# EAGLE design PixiFlood (EAGLE 9.4.2)
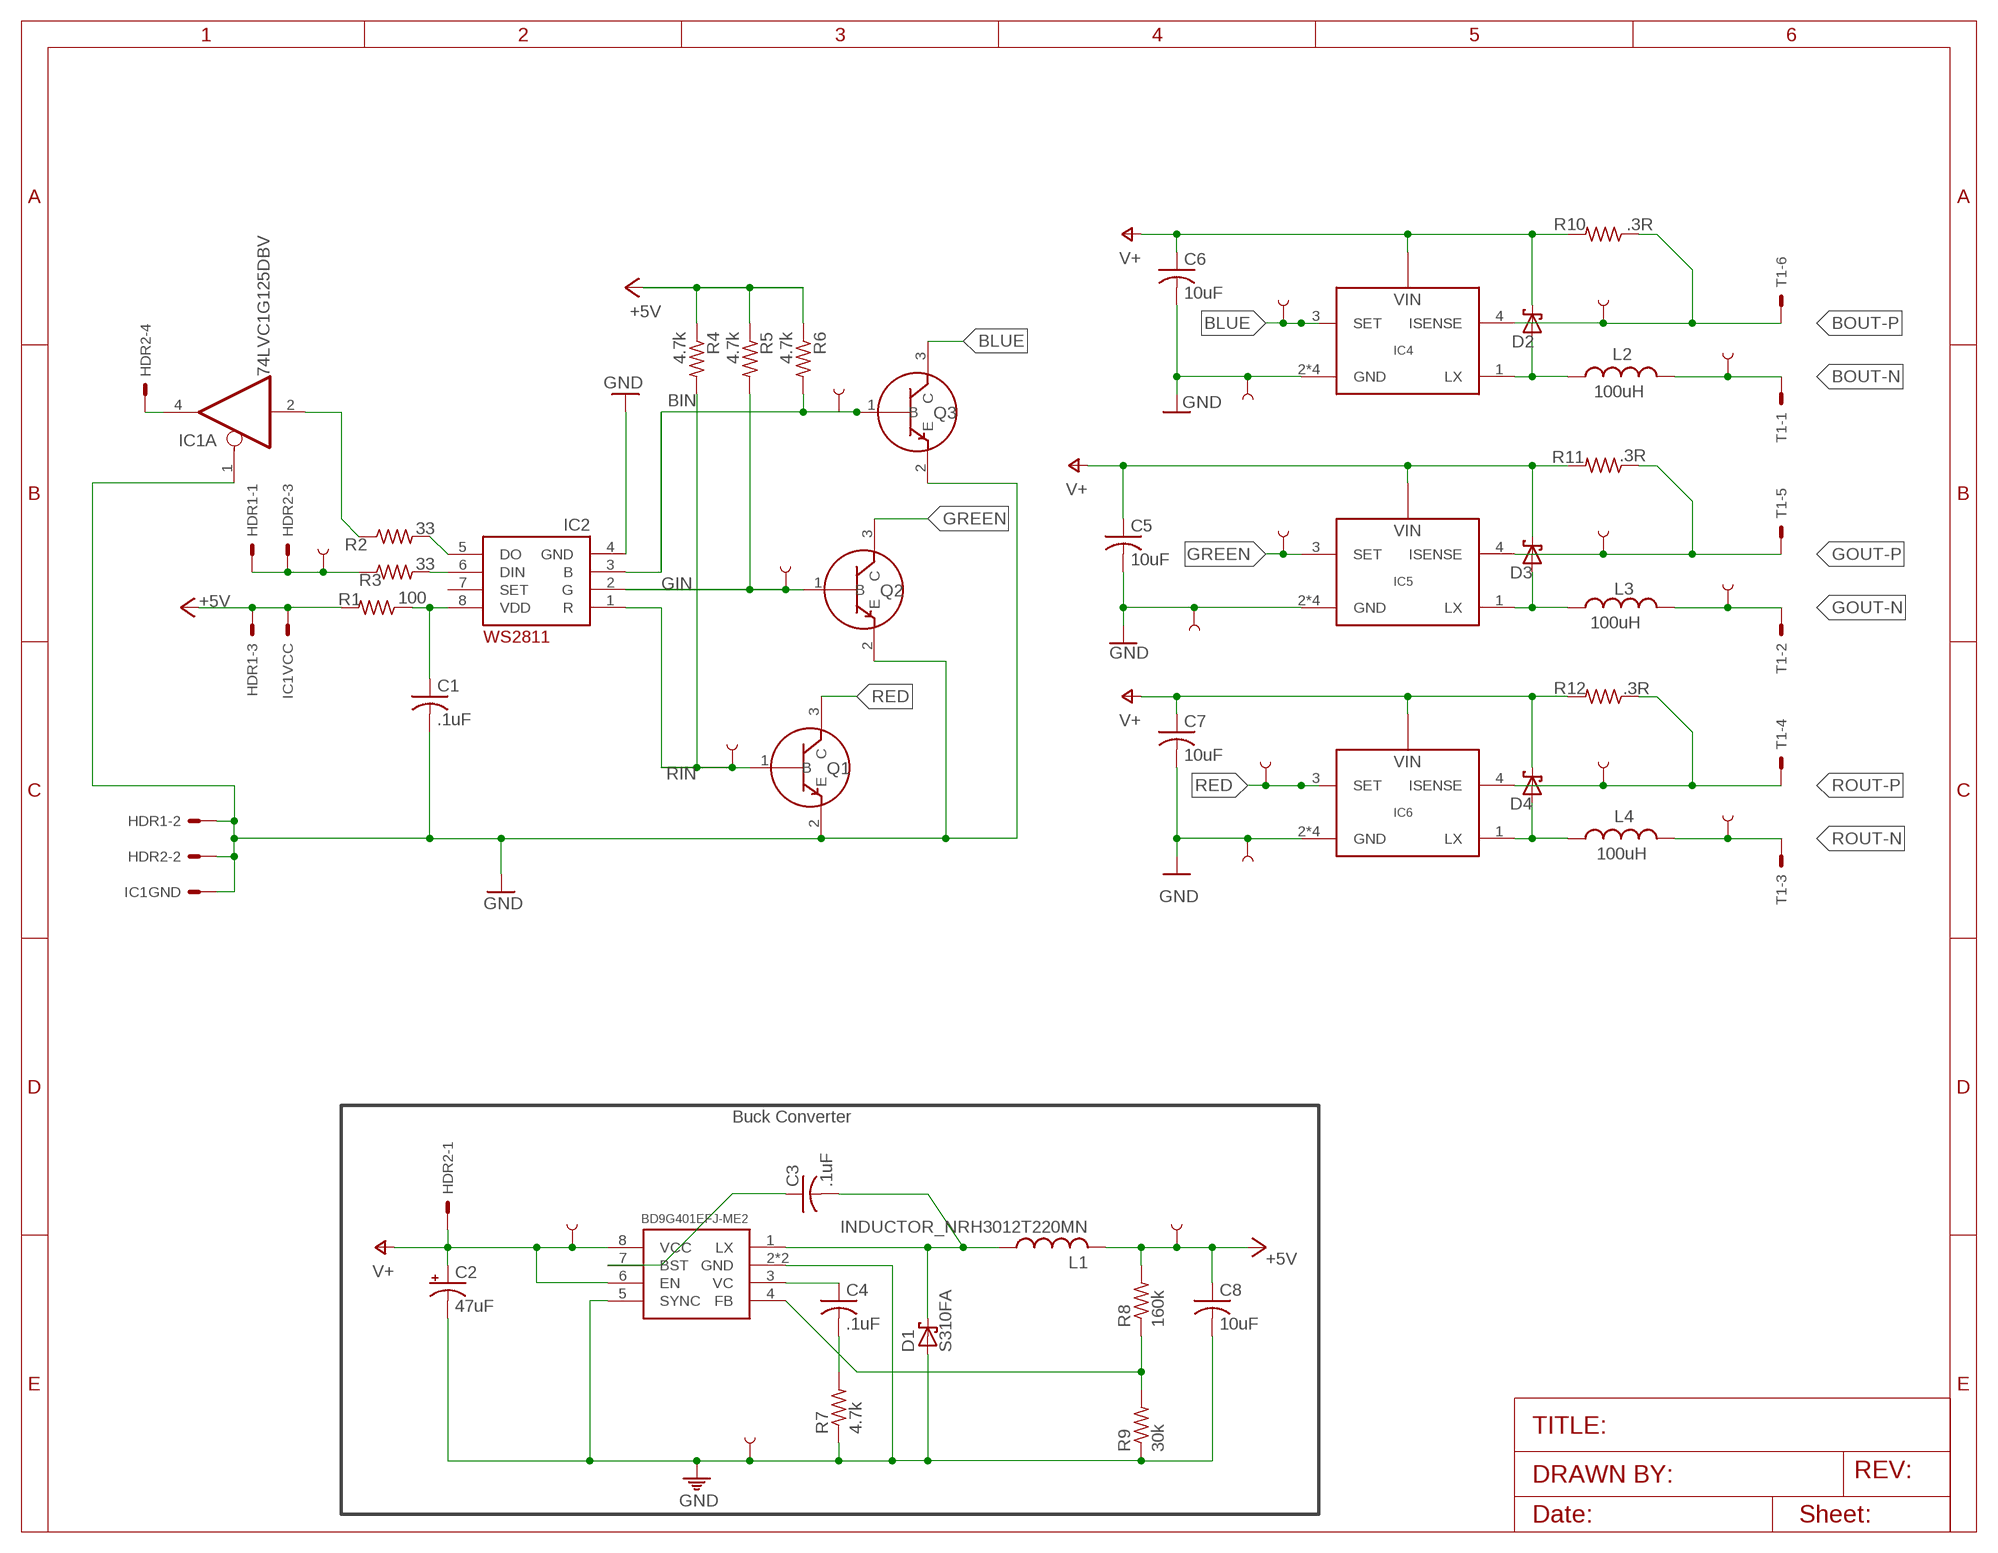
[diagram p0: schematic, sheet 1]

## Parts
C1  .1uF  C-USC0805  [C0805]
C2  47uF  CPOL-USUD-6,3X7,7  [UD-6,3X7,7_NICHICON]
C3  .1uF  C-USC0805  [C0805]
C4  .1uF  C-USC0805  [C0805]
C5  10uF  C-USC1206  [C1206]
C6  10uF  C-USC1206  [C1206]
C7  10uF  C-USC1206  [C1206]
C8  10uF  C-USC1206  [C1206]
D1  S310FA  SCHOTTKY-DIODES310FA  [SOD-123FL]
D2  S310FA  SCHOTTKY-DIODES310FA  [SOD-123FL]
D3  S310FA  SCHOTTKY-DIODES310FA  [SOD-123FL]
D4  S310FA  SCHOTTKY-DIODES310FA  [SOD-123FL]
HDR1  M03FEMALE  [1X03_FEMALE]
HDR2  M04STD  [1X04]
IC1  74LVC1G125DBV  [SOT23-5]
IC2  WS2811SOP8  [SO08-P-1.27]
IC3  BD9G401EFJ-ME2  [SOIC127P600X100-9N]
IC4  AL-8861SOT89-5  [SOT89-5]
IC5  AL-8861SOT89-5  [SOT89-5]
IC6  AL-8861SOT89-5  [SOT89-5]
L1  INDUCTOR_NRH3012T220MN  [IND_TAIYO_NRH3012]
L2  100uH  INDUCTOR_TDK  [SLF7045]
L3  100uH  INDUCTOR_TDK  [SLF7045]
L4  100uH  INDUCTOR_TDK  [SLF7045]
Q1  BC847BC847  [SOT23-3]
Q2  BC847BC847  [SOT23-3]
Q3  BC847BC847  [SOT23-3]
R1  100  R-US_R0805  [R0805]
R2  33  R-US_R0805  [R0805]
R3  33  R-US_R0805  [R0805]
R4  4.7k  R-US_R0805  [R0805]
R5  4.7k  R-US_R0805  [R0805]
R6  4.7k  R-US_R0805  [R0805]
R7  4.7k  R-US_R0805  [R0805]
R8  160k  R-US_R0805  [R0805]
R9  30k  R-US_R0805  [R0805]
R10  .3R  R-US_R1210  [R1210]
R11  .3R  R-US_R1210  [R1210]
R12  .3R  R-US_R1210  [R1210]
T1  M06SIP  [1X06]
TP1  ROUT-N  TEST_PINTP-1  [TP-1]
TP2  GOUT-N  TEST_PINTP-1  [TP-1]
TP3  BOUT-N  TEST_PINTP-1  [TP-1]
TP4  RED  TEST_PINTP-1  [TP-1]
TP5  BLUE  TEST_PINTP-1  [TP-1]
TP6  GREEN  TEST_PINTP-1  [TP-1]
TP7  BOUT-P  TEST_PINTP-1  [TP-1]
TP8  GOUT-P  TEST_PINTP-1  [TP-1]
TP9  ROUT-R  TEST_PINTP-1  [TP-1]
TP11  RIN  TEST_PINTP-1  [TP-1]
TP12  VIN  TEST_PINTP-1  [TP-1]
TP13  DIN  TEST_PINTP-1  [TP-1]
TP14  GND  TEST_PINTP-1  [TP-1]
TP15  5V  TEST_PINTP-1  [TP-1]
TP19  GND  TEST_PINTP-1  [TP-1]
TP20  GND  TEST_PINTP-1  [TP-1]
TP21  BIN  TEST_PINTP-1  [TP-1]
TP22  GIN  TEST_PINTP-1  [TP-1]
TP23  GND  TEST_PINTP-1  [TP-1]

## Nets
+5V [+5V]: C8.1 HDR1.5 IC1.5(VCC:S) L1.2 R1.2 R4.1 R5.1 R6.1 R8.2 TP15.P$1
BIN: IC2.3(B) Q3.1(B) R6.2 TP21.P$1
BLUE: IC4.3(SET) Q3.3(C) TP5.P$1
BOUT-N: L2.2 T1.1 TP3.P$1
BOUT-P: IC4.4(ISENSE) R10.1 T1.6 TP7.P$1
DIN-IN: HDR1.1 HDR2.3 R3.1 TP13.P$1
DO: HDR2.4 IC1.4(A:O)
GIN: IC2.2(G) Q2.1(B) R5.2 TP22.P$1
GND: C1.2 C2.- C5.2 C6.2 C7.2 C8.2 D1.A HDR1.3 HDR2.2 IC1.1(A:OE) IC1.3(GND:S) IC2.4(GND) IC3.2(GND) IC3.5(SYNC) IC3.9(GND) IC4.2(GND) IC4.2@1(GND) IC4.2@2(GND) IC4.2@3(GND) IC5.2(GND) IC5.2@1(GND) IC5.2@2(GND) IC5.2@3(GND) IC6.2(GND) IC6.2@1(GND) IC6.2@2(GND) IC6.2@3(GND) Q1.2(E) Q2.2(E) Q3.2(E) R7.1 R9.1 TP14.P$1 TP19.P$1 TP20.P$1 TP23.P$1
GOUT-N: L3.2 T1.2 TP2.P$1
GOUT-P: IC5.4(ISENSE) R11.1 T1.5 TP8.P$1
GREEN: IC5.3(SET) Q2.3(C) TP6.P$1
N$1: C4.1 IC3.3(VC)
N$2: D4.A IC6.1(LX) L4.1
N$3: C3.2 D1.C IC3.1(LX) L1.1
N$4: IC1.2(A:I) R2.1
N$5: D3.A IC5.1(LX) L3.1
N$6: IC2.5(DO) R2.2
N$9: IC2.6(DIN) R3.2
N$17: C4.2 R7.2
N$18: D2.A IC4.1(LX) L2.1
N$20: IC3.4(FB) R8.1 R9.2
N$21: C3.1 IC3.7(BST)
RED: IC6.3(SET) Q1.3(C) TP4.P$1
RIN: IC2.1(R) Q1.1(B) R4.2 TP11.P$1
ROUT-N: L4.2 T1.3 TP1.P$1
ROUT-P: IC6.4(ISENSE) R12.1 T1.4 TP9.P$1
V+ [+V]: C2.+ C5.1 C6.1 C7.1 D2.C D3.C D4.C HDR2.1 IC3.6(EN) IC3.8(VCC) IC4.5(VIN) IC5.5(VIN) IC6.5(VIN) R10.2 R11.2 R12.2 TP12.P$1
VDD [vcc]: C1.1 IC2.8(VDD) R1.1
Unconnected: IC2.7(SET)

## Notes on the sheet
- Buck Converter

## Library data of the parts
C1 C3-C8 = rcl:C-US: CAPACITOR, American symbol; SPICEPREFIX: C
C2 = rcl:CPOL-US: POLARIZED CAPACITOR, American symbol; SPICEPREFIX: C
D1-D4 = diode:SCHOTTKY-DIODE: Schottky Diode DIODE SCHOTTKY 100V 3A SOD123FA ON Semiconductor
HDR1 = headers:M03: Header 3 Standard 3-pin 0.1" header. Use with straight break away headers (SKU : PRT-00116), right angle break away headers (PRT-00553), swiss pins (PRT-00743), machine pins (PRT-00117), and female headers (PRT-00115). Molex polarized connector foot print use with SKU : PRT-08232 with associated crimp pins and housings.
HDR2 = headers:M04: Header 4 Standard 4-pin 0.1" header. Use with straight break away headers (SKU : PRT-00116), right angle break away headers (PRT-00553), swiss pins (PRT-00743), machine pins (PRT-00117), and female headers (PRT-00115). Molex polarized connector foot print use with SKU : PRT-08231 with associated crimp pins and housings. 1MM SMD Version SKU: PRT-10208
IC1 = logic:74*1G125: Single Bus Buffer Gate with 3-State Output
IC2 = drivers:WS2811
IC3 = regulators:BD9G401EFJ-ME2
IC4-IC6 = drivers:AL-8861
L1 = rcl:INDUCTOR_: Bourns SRR4528A Series 100 uH +/-20% Ferrite Multilayer SMD Inductor, SMD Case, SRF: 10MHz 0.56A dc 609m Rdc Source: Datasheet <https://www.bourns.com/docs/Product-Datasheets/SRR4528A.pdf>; VENDOR: TAIYO YUDEN
L2-L4 = rcl:INDUCTOR_: Bourns SRR4528A Series 100 uH +/-20% Ferrite Multilayer SMD Inductor, SMD Case, SRF: 10MHz 0.56A dc 609m Rdc Source: Datasheet <https://www.bourns.com/docs/Product-Datasheets/SRR4528A.pdf>
Q1-Q3 = transistor:BC847
R1-R12 = rcl:R-US_: RESISTOR, American symbol; SPICEPREFIX: R
T1 = headers:M06: Header 6 Standard 6-pin 0.1" header. Use with straight break away headers (SKU : PRT-00116), right angle break away headers (PRT-00553), swiss pins (PRT-00743), machine pins (PRT-00117), and female headers (PRT-00115). Molex polarized connector foot print use with SKU : PRT-08094 with associated crimp pins and housings. NOTES ON THE VARIANTS LOCK and LOCK_LONGPADS... This footprint was designed to help hold the alignment of a through-hole component (i.e. 6-pin header) while soldering it into place. You may notice that each hole has been shifted either up or down by 0.005 of an inch from it's more standard position (which is a perfectly straight line). This slight alteration caused the pins (the squares in the middle) to touch the edges of the holes. Because they are alternating, it causes a "brace" to hold the component in place. 0.005 has proven to be the perfect amount of "off-center" position when using our standard breakaway headers. Although looks a little odd when you look at the bare footprint, once you have a header in there, the alteration is very hard to notice. Also, if you push a header all the way into place, it is covered up entirely on the bottom side. This idea of altering the position of holes to aid alignment will be further integrated into the Sparkfun Library for other footprints. It can help hold any component with 3 or more connection pins.
TP1-TP9 TP11-TP15 TP19-TP23 = headers:TEST_PIN

## Net classes
0 default: width 0.305 mm, clearance 0.205 mm
1 vcc: width 0.406 mm
2 +V: width 0.61 mm
3 +5V: width 0.406 mm

## Board
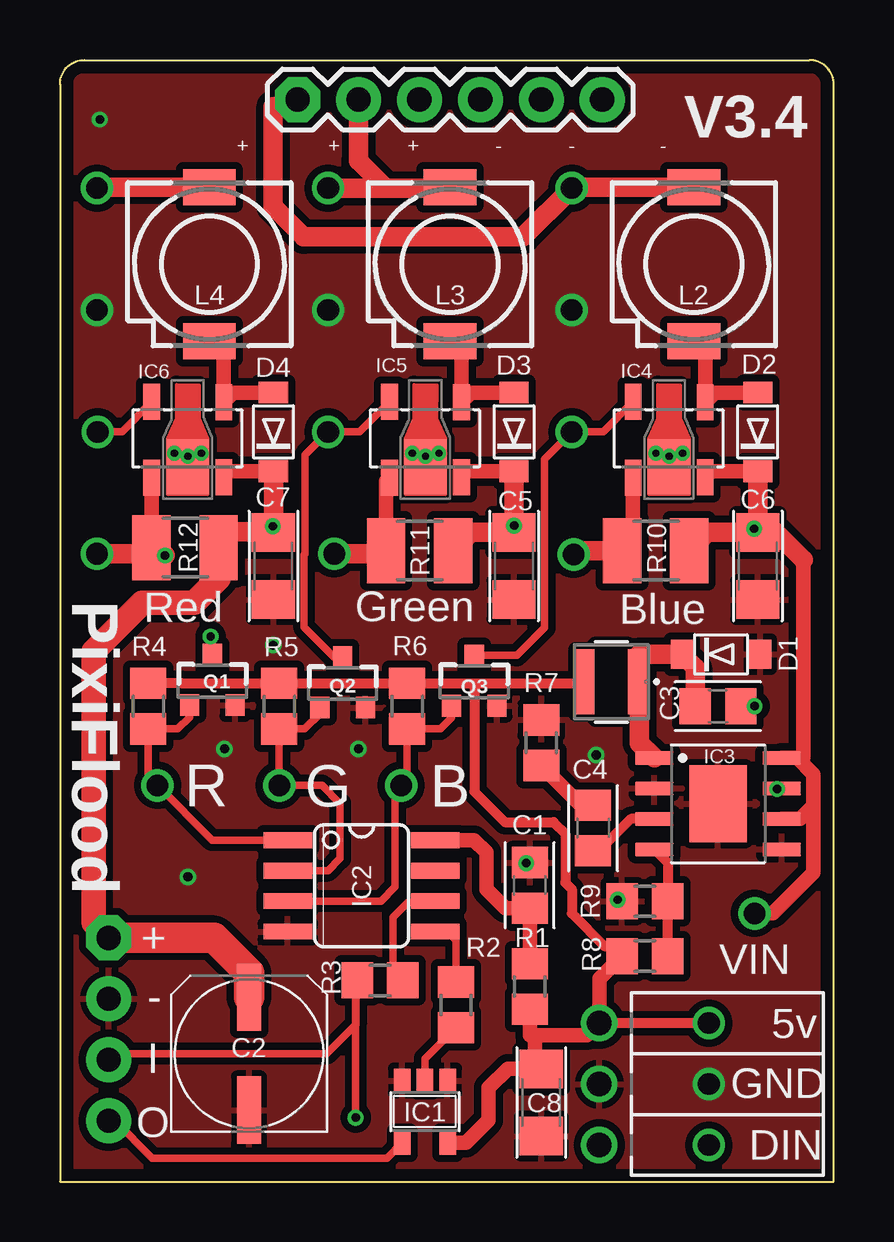
[diagram p1: board, top side]
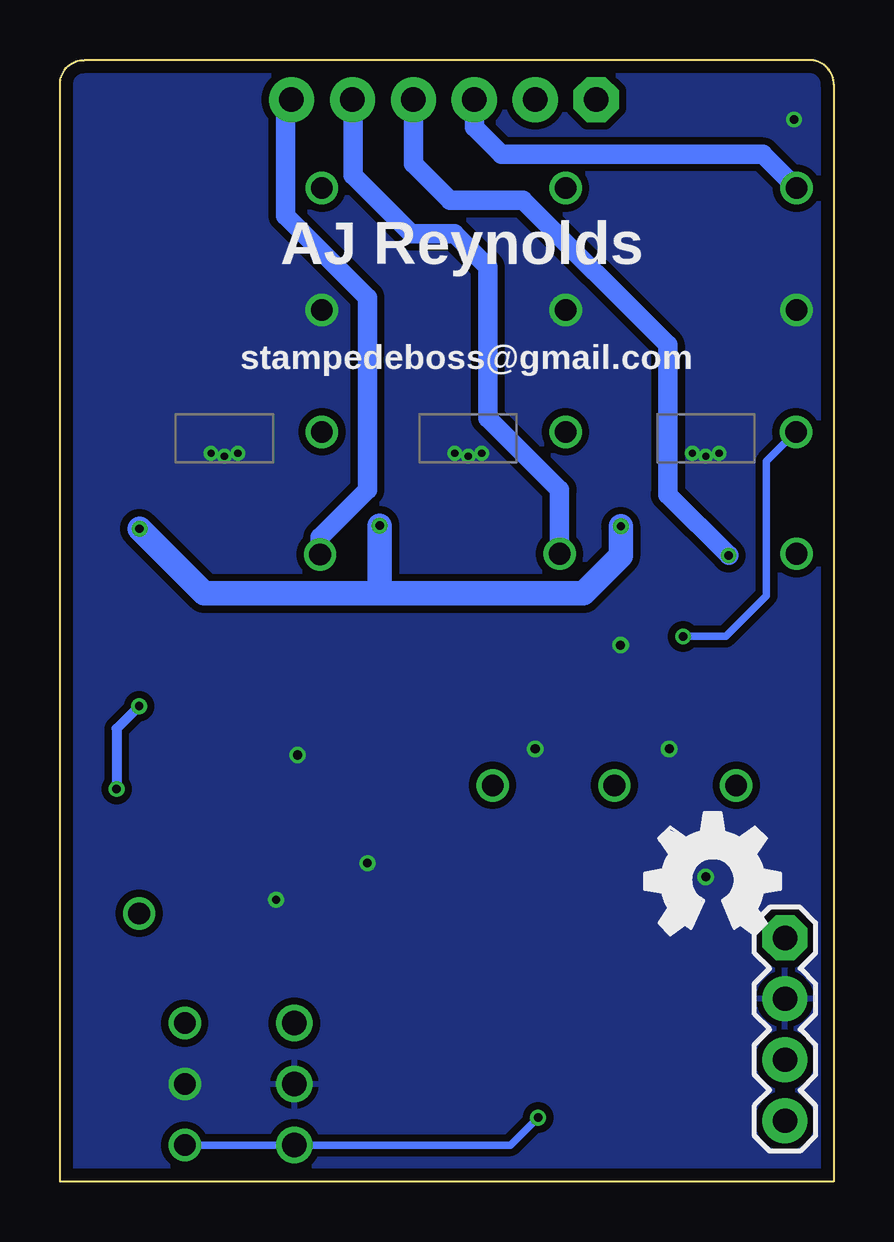
[diagram p2: board, bottom side, seen from below]

Size 32.26 x 46.74 mm. Coordinates in mm from the lower left corner, seen from the top.
Outline: 1.02,46.74 31.24,46.74 arc-90 32.26,45.72 32.26,0 0,0 0,45.72 arc-90 1.02,46.74
Copper layers (1*16): Top 0.035mm / dielectric 1.6mm / Bottom 0.035mm
Design rules "Elecrow_2-layer_PCB_eagle_rule *": minimum track width 6mil, minimum drill 12mil, track to track 6mil, track to pad 6mil, pad to pad 6mil, via to via 8mil, smd to smd 6mil, copper to edge 20mil, drill to drill 10mil, minimum pad ring 6mil, minimum via ring 6mil, stop-mask expansion 0mil, vias tented up to drill 100mil, thermal gap 10mil

### Footprints (pad centres in the part's own frame; a part is rotated, then mirrored left to right if it is on the bottom)
C0805 = smd 1.3 x 1.5: 1 -0.95,0; 2 0.95,0
UD-6,3X7,7_NICHICON = smd 2.8 x 1: + 2.35,0; - -2.35,0
C1206 = smd 1.6 x 1.8: 1 -1.4,0; 2 1.4,0
SOD-123FL = smd 0.91 x 1.22: A 1.637,0; C -1.637,0
1X03_FEMALE = drill 1.016: 1 -2.54,0; 3 0,0; 5 2.54,0
1X04 = drill 1.016 pad 1.88 octagon: 1 -3.81,0 | drill 1.016 pad 1.88: 2 -1.27,0; 3 1.27,0; 4 3.81,0
SOT23-5 = smd 0.69 x 0.99: 1 -0.95,-1.29; 2 0,-1.29; 3 0.95,-1.29; 4 0.95,1.3; 5 -0.95,1.3
SO08-P-1.27 = smd 2.032 x 0.66: 1 -3.073,1.905; 2 -3.073,0.635; 3 -3.073,-0.635; 4 -3.073,-1.905; 5 3.073,-1.905; 6 3.073,-0.635; 7 3.073,0.635; 8 3.073,1.905
SOIC127P600X100-9N = smd 1.61 x 0.58: 1 -2.655,1.905; 2 -2.655,0.635; 3 -2.655,-0.635; 4 -2.655,-1.905; 5 2.655,-1.905; 6 2.655,-0.635; 7 2.655,0.635; 8 2.655,1.905 | smd 2.4 x 3.2: 9 0,0
SOT89-5 = smd 0.7 x 1.5: 1 -1.496,-1.496; 3 1.505,-1.498; 4 1.505,1.654; 5 -1.496,1.645 | smd 1.778 x 2.286: 2 0.006,1.201 | drill 0.305 pad 0.305: 2@1 -0.559,0.635; 2@2 0,0.762; 2@3 0.559,0.635
IND_TAIYO_NRH3012 = smd 0.8 x 2.692: 1 -1.099,0; 2 1.099,0
SLF7045 = smd 1.5 x 2.2: 1 -3.2,0; 2 3.2,0
SOT23-3 = smd 0.8 x 0.9: 1 -0.95,-1; 2 0.95,-1; 3 0,1.1
R0805 = smd 1.3 x 1.5: 1 -0.95,0; 2 0.95,0
R1210 = smd 1.6 x 2.7: 1 -1.4,0; 2 1.4,0
1X06 = drill 1.016 pad 1.88 octagon: 1 -6.35,0 | drill 1.016 pad 1.88: 2 -3.81,0; 3 -1.27,0; 4 1.27,0; 5 3.81,0; 6 6.35,0
TP-1 = drill 0.9 pad 1.016: P$1 0,0

### Placement (x,y rotation side)
C1  19.58,12.34 90 top
C2  7.88,5.33 90 top
C3  27.43,19.81 180 top
C4  22.23,14.73 90 top
C5  18.93,25.65 270 top
C6  29.09,25.65 270 top
C7  8.9,25.65 270 top
C8  20.07,3.3 270 top
D1  27.56,21.97 0 top
D2  29.09,31.24 90 top
D3  18.93,31.24 90 top
D4  8.9,31.24 90 top
HDR1  22.49,4.06 90 top
HDR2  2.03,6.35 270 bottom
IC1  15.22,2.92 180 top
IC2  12.57,12.33 0 top
IC3  27.43,15.75 0 top
IC4  25.4,30.99 180 top
IC5  15.24,30.99 180 top
IC6  5.33,30.99 180 top
L1  22.99,20.83 180 top
L2  26.42,38.23 90 top
L3  16.26,38.23 90 top
L4  6.23,38.23 90 top
LOGO  [OSHW_FILLX200_NOTEXT]  7.88,10.29 0 bottom
Q1  6.35,20.85 0 top
Q2  11.79,20.75 0 top
Q3  17.27,20.83 0 top
R1  19.58,8.13 270 top
R2  16.51,7.37 90 top
R3  13.34,8.38 0 top
R4  3.68,19.81 270 top
R5  9.14,19.81 270 top
R6  14.48,19.81 270 top
R7  20.07,18.29 270 top
R8  24.38,9.4 180 top
R9  24.38,11.68 0 top
R10  24.84,26.29 0 top
R11  14.99,26.29 0 top
R12  5.21,26.42 0 top
T1  16.26,45.09 0 top
TP1  1.55,41.4 180 top
TP2  11.18,41.4 0 top
TP3  21.34,41.4 180 top
TP4  1.57,31.24 180 top
TP5  21.34,31.24 180 top
TP6  11.18,31.24 180 top
TP7  21.41,26.14 0 top
TP8  11.43,26.16 0 top
TP9  1.55,26.16 180 top
TP11  4.06,16.51 270 top
TP12  28.96,11.18 0 top
TP13  27.05,1.52 0 top
TP14  1.55,36.32 0 top
TP15  27.05,6.6 0 top
TP19  27.05,4.06 0 top
TP20  11.18,36.32 0 top
TP21  14.22,16.51 90 top
TP22  9.14,16.51 90 top
TP23  21.34,36.32 0 top

### Tracks (layer width: path | path; a pad name or v marks a point on that pad's centre or on a via)
+5V
  Top 0.406: HDR1.5 22.5,6.61 22.5,6.6 TP15.P$1 | R4.1 3.71,20.79 5.07,20.79 5.1,20.76 R5.1 R6.1 17.27,20.76 | L1.2 21.82,20.76 17.27,20.76 | 17.27,20.76 17.27,16.26 18.54,14.99 20.57,14.99 21.07,14.49 21.07,12.46 21.34,12.19 21.34,11.18 22.7,9.82 23.43,9.82
  Top 0.61: R1.2 19.58,6.1 19.81,6.1 | 19.81,6.1 19.81,4.96 C8.1 18.67,4.7 17.87,3.91 17.87,2.56 16.93,1.62 IC1.5 | 19.81,6.1 21.98,6.1 HDR1.5 22.49,8.45 R8.2 23.43,9.82
BIN
  Top 0.305: IC2.3 13.38,11.69 13.98,12.29 13.98,16.26 TP21.P$1 14.48,16.76 R6.2 15.86,18.86 16.32,19.32 Q3.1
BLUE
  Top 0.305: Q3.3 19.05,21.93 20.2,23.08 20.2,30.11 TP5.P$1 22.65,31.24 IC4.3
BOUT-N
  Top 0.813: L2.2 21.36,41.43 TP3.P$1 19.3,39.37 10.16,39.37 8.89,40.64 8.89,44.78 T1.1
BOUT-P
  Top 0.61: IC4.4 23.9,26.75 R10.1
  Top 0.813: R10.1 21.57,26.29 TP7.P$1
  Bottom 0.813: TP7.P$1 21.41,26.85 19.44,28.82 19.44,36.83 22.86,40.25 22.86,44.58 T1.6
DIN-IN  (via drill 0.35)
  Top 0.305: R3.1 12.34,8.33 12.34,7.69 | 12.34,7.69 12.33,7.67 v12.33,2.67 | 12.34,7.69 12.34,6.55 11.12,5.33 2.29,5.33 HDR2.3
  Bottom 0.305: v12.33,2.67 13.47,1.52 HDR1.1 TP13.P$1
DO
  Top 0.305: IC1.4 13.63,0.99 3.85,0.99 2.29,2.54 HDR2.4
GIN
  Top 0.305: IC2.2 11.18,12.96 11.68,13.47 11.68,15.75 10.92,16.51 TP22.P$1 R5.2 10.2,18.86 10.84,19.5 Q2.1
GND  (via drill 0.35, 0.38)
  other vias: 1.66,44.26 23.25,11.75 19.44,13.27 5.33,12.7 8.89,22.35 6.86,18.03 12.45,18.03 22.35,17.78
  pour Top (isolate 0.305): 0,0 0,46.74 32.26,46.74 32.26,0
  pour Bottom (isolate 0.305): 0,0 0,46.74 32.26,46.74 32.26,0
GOUT-N
  Top 0.813: TP2.P$1 13.59,41.4 | 13.59,41.4 16.24,41.4 L3.2 | 13.59,41.4 12.45,42.55 T1.2
GOUT-P
  Top 0.61: R11.1 13.59,29.19 IC5.4
  Top 0.813: R11.1 13.47,26.16 TP8.P$1
  Bottom 0.813: TP8.P$1 11.43,28.82 14.42,31.81 14.42,38.1 15.82,39.5 17.61,39.5 20.05,41.93 20.05,45.06 T1.5
GREEN
  Top 0.305: Q2.3 11.42,21.85 10.18,23.09 10.18,26.12 10.22,26.16 10.22,30.29 TP6.P$1 12.49,31.24 IC5.3
N$1
  Top 0.406: IC3.3 23.81,15.11 22.48,13.78 C4.1
N$2
  Top 0.61: L4.1 6.6,35.03 6.83,34.8 IC6.1 7.23,32.88 D4.A
N$3
  Top 0.406: L1.1 24.16,20.75
  Top 0.61: L1.1 24.16,20.83
  Top 0.813: 24.16,20.83 24.16,21.97 D1.C 26.48,21.41 C3.2 | 24.16,20.75 24.16,18.27 IC3.1
N$4
  Top 0.305: R2.1 15.22,5.12 IC1.2
N$5
  Top 0.61: L3.1 16.74,34.55 IC5.1 17.13,32.88 D3.A
N$6
  Top 0.305: IC2.5 16.15,10.42 16.51,10.07 R2.2
N$9
  Top 0.305: IC2.6 15.57,11.62 14.48,11.62 13.88,11.01 13.88,8.8 R3.2
N$17
  Top 0.61: C4.2 21.72,15.68 R7.2
N$18
  Top 0.61: L2.1 26.9,34.55 IC4.1 27.29,32.88 D2.A
N$20
  Top 0.406: IC3.4 25.33,13.29 R9.2 R8.1
N$21  (via drill 0.35)
  Top 0.406: C3.1 v28.96,19.81 | v29.9,16.36 29.92,16.38 IC3.7
  Bottom 0.406: v28.96,19.81 29.9,18.87 v29.9,16.36
RED  (via drill 0.35)
  Top 0.305: Q1.3 6.35,22.65 v6.28,22.72 | IC6.3 2.58,31.24 TP4.P$1
  Bottom 0.305: v6.28,22.72 4.5,22.72 2.8,24.42 2.8,30.02 TP4.P$1
RIN
  Top 0.305: IC2.1 6.34,14.23 TP11.P$1 3.68,16.89 R4.2 4.92,18.86 5.4,19.34 Q1.1
ROUT-N
  Top 0.305: 1.57,41.43 TP1.P$1
  Top 0.813: L4.2 1.57,41.43
  Bottom 0.813: TP1.P$1 2.95,42.8 13.84,42.8 14.99,43.94 T1.3
ROUT-P  (via drill 0.35)
  Top 0.61: IC6.4 3.83,26.43 R12.1
  Top 0.813: v4.38,26.09 4.14,26.09 R12.1 3.56,26.16 TP9.P$1
  Bottom 0.813: v4.38,26.09 6.92,28.63 6.92,34.86 12.95,40.89 16,40.89 17.53,42.42 T1.4
V+  (via drill 0.35)
  Top 0.61: 30.99,25.91 30.99,17.65 30.73,17.65 | C6.1 v28.94,27.21 | IC4.5 27.15,29.61 D2.C | IC5.5 16.99,29.61 D3.C | IC6.5 7.08,29.61 D4.C | IC3.8 30.73,17.65 | IC3.6 30.86,15.11 31.4,15.65 | 31.4,15.65 31.4,16.98 30.73,17.65 | TP12.P$1 29.72,11.18 31.41,12.87 31.41,15.65 31.4,15.65
  Top 0.813: C6.1 D2.C | C5.1 v18.93,27.33 | C5.1 D3.C | v8.87,27.31 v8.86,27.32 8.86,27.09 | 8.86,27.09 C7.1 D4.C | R12.2 7.29,27.09 8.86,27.09 | 30.99,25.91 29.84,27.05 C6.1 | R10.2 27,27.05 C6.1 | R11.2 17.16,27.05 C5.1
  Top 1.016: R12.2 6.62,25.15 5.59,24.13 3.43,24.13 1.41,22.1 1.41,10.79 HDR2.1
  Top 1.27: C2.+ 7.88,8.7 6.42,10.16 HDR2.1
  Bottom 1.016: v8.87,27.31 8.87,26.07 10.43,24.51 18.93,24.51 | v28.94,27.21 26.24,24.51 18.93,24.51 | v18.93,27.33 18.93,24.51
VDD
  Top 0.61: R1.1 C1.1 18.58,11.39 17.78,12.19 17.78,13.72 17.26,14.23 IC2.8

### Text on the board
tPlace: V3.4 | + | + | + | - | - | - | Red | Green | Blue | PixiFlood | R | G | B | + | VIN | - | 5v | I | GND | O | DIN
bPlace: AJ Reynolds | stampedeboss@gmail.com